# Altium schematic sheet Battery Management.SchDoc
size A
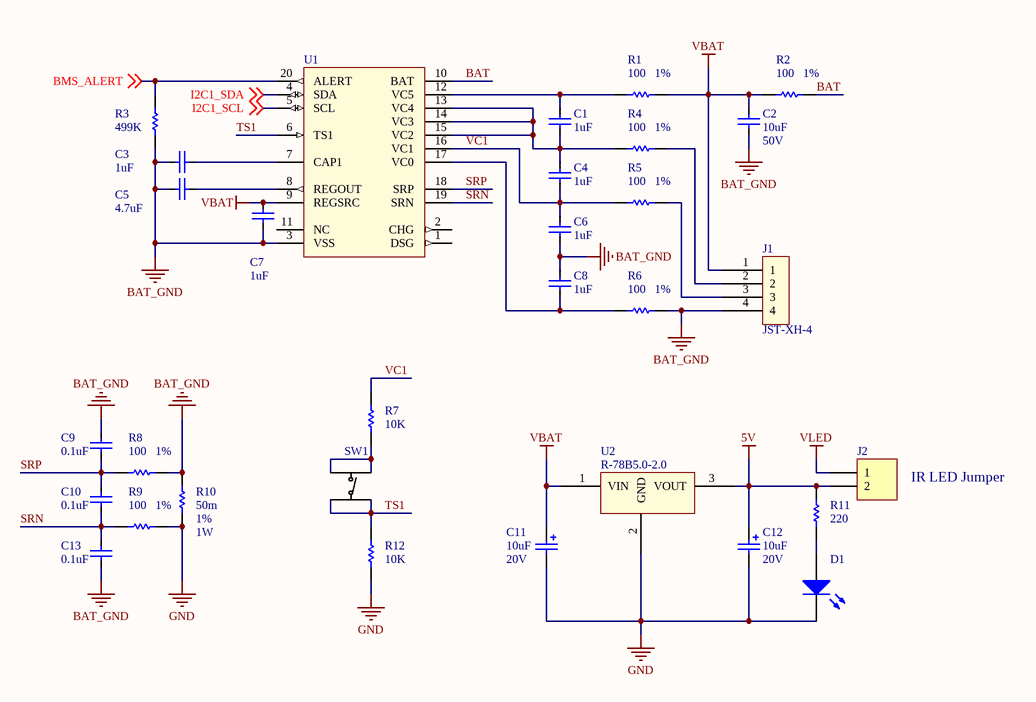
[diagram p0: Battery Management.SchDoc]

## Parts
C1  value 1uF  [C0805]  (hidden comment: CAP)
C2  value 10uF  Voltage - Rated: 50V  [1206]  (hidden comment: CAP)
C3  value 1uF  [C0805]  (hidden comment: CAP)
C4  value 1uF  [C0805]  (hidden comment: CAP)
C5  value 4.7uF  [C0805]  (hidden comment: CAP)
C6  value 1uF  [C0805]  (hidden comment: CAP)
C7  value 1uF  [C0805]  (hidden comment: CAP)
C8  value 1uF  [C0805]  (hidden comment: CAP)
C9  value 0.1uF  [J1-0603]  (hidden comment: CAP)
C10  value 0.1uF  [J1-0603]  (hidden comment: CAP)
C11  value 10uF  Voltage Rating: 20V  [1206+]  (hidden comment: CAP POL)
C12  value 10uF  Voltage Rating: 20V  [1206+]  (hidden comment: CAP POL)
C13  value 0.1uF  [J1-0603]  (hidden comment: CAP)
D1  LED  [0603-DI-GREEN]  (value not drawn)
J1  JST-XH-4  [JST-XH-4]
J2  Header 2  [HDR1X2]  (value not drawn)
R1  value 100  Tolerance: 1%  [J1-0603]
R2  value 100  Tolerance: 1%  [J1-0603]
R3  value 499K  [J1-0603]
R4  value 100  Tolerance: 1%  [J1-0603]
R5  value 100  Tolerance: 1%  [J1-0603]
R6  value 100  Tolerance: 1%  [J1-0603]
R7  value 10K  [J1-0603]
R8  value 100  Tolerance: 1%  [J1-0603]
R9  value 100  Tolerance: 1%  [J1-0603]
R10  value 50m  Tolerance: 1%  Power Rating: 1W  [RESC6332]
R11  value 220  [J1-0603]
R12  value 10K  [J1-0603]
SW1  TACT SWITCH  [TACT SWITCH]  (value not drawn)
U1  bq76920  [TSSOP20]  (value not drawn)
U2  Manufacturer Part Number: R-78B5.0-2.0  [SIP-3]  (hidden comment: R-78BXX-XX)

## Nets
5V: C12.1 J2.2 R11.1 U2.3(VOUT)
BAT_GND: C2.2 C3.1 C5.2 C6.1 C7.1 C8.2 C9.2 C13.1 J1.4 R3.1 R6.1 R8.1 R10.1 U1.3(VSS)
GND: C11.2 C12.2 D1.2(K) R9.1 R10.2 R12.2 U2.2(GND)
VBAT: C2.1 C7.2 C11.1 J1.1 R1.1 R2.2 U1.9(REGSRC) U2.1(VIN)
VLED: J2.1
BAT: R2.1 U1.10(BAT)
BMS_ALERT: R3.2 U1.20(ALERT) ; off-sheet BMS_ALERT
I2C1_SCL: U1.5(SCL) ; off-sheet I2C1_SCL
I2C1_SDA: U1.4(SDA) ; off-sheet I2C1_SDA
SRN: C10.1 C13.2 R9.2 U1.19(SRN)
SRP: C9.1 C10.2 R8.2 U1.18(SRP)
TS1: R12.1 SW1.3 SW1.4 U1.6(TS1)
VC1: C4.1 C6.2 R5.2 R7.1 U1.16(VC1)
NetC1_1: C1.1 C4.2 R4.2 U1.13(VC4) U1.14(VC3) U1.15(VC2)
NetC1_2: C1.2 R1.2 U1.12(VC5)
NetC3_2: C3.2 U1.7(CAP1)
NetC5_1: C5.1 U1.8(REGOUT)
NetC8_1: C8.1 R6.2 U1.17(VC0)
NetD1_1: D1.1(A) R11.2
NetJ1_2: J1.2 R4.1
NetJ1_3: J1.3 R5.1
NetR7_2: R7.2 SW1.1 SW1.2

Not connected (* = marked no-connect by the designer): U1 1(DSG) 2(CHG) 11(NC)

## Notes on the sheet
- IR LED Jumper

## Library data of the parts
C1 C3 C4 C6-C8 = CAP: CAP CER 1UF 25V X7R 0805; Manufacturer: Murata Electronics North America; Manufacturer Part Number: GCM21BR71E105KA56L; Tolerance: ±10%; Supplier 1: Digi-Key; Supplier Part Number 1: 490-4785-1-ND; RoHS: RoHS Compliant; Category: Capacitors; Stock 1: 30000; Pricing 1: 1=0.29, 10=0.198, 100=0.1122, 500=0.07918, 1000=0.06927 (USD); Packaging: Cut Tape (CT); Part Status: Active; Voltage - Rated: 25V; Temperature Coefficient: X7R; Operating Temperature: -55°C ~ 125°C; Features: -; Ratings: AEC-Q200; Applications: Automotive; Mounting Type: Surface Mount, MLCC; Package / Case: 0805 (2012 Metric); Size / Dimension: 0.079" L x 0.049" W (2.00mm x 1.25mm); Height - Seated (Max): -; Thickness (Max): 0.055" (1.40mm); Lead Spacing: -; Lead Style: -; ComponentLink1URL: http://search.murata.co.jp/Ceramy/image/img/A01X/G101/ENG/GCM21BR71E105KA56-01.pdf; ComponentLink1Description: http://search.murata.co.jp/Ceramy/image/img/A01X/G101/ENG/GCM21BR71E105KA56-01.pdf
C2 = CAP: CAP CER 10UF 50V X5R 1206; Manufacturer: Murata Electronics North America; Manufacturer Part Number: GRT31CR61H106KE01L; Tolerance: ±10%; Supplier 1: Digi-Key; Supplier Part Number 1: 490-12456-1-ND; RoHS: RoHS Compliant; Category: Capacitors; Stock 1: 20000; Pricing 1: 1=0.89, 10=0.633, 100=0.4166, 500=0.30856, 1000=0.26228 (USD); Packaging: Cut Tape (CT); Part Status: Active; Temperature Coefficient: X5R; Operating Temperature: -55°C ~ 85°C; Features: -; Ratings: AEC-Q200; Applications: Automotive; Mounting Type: Surface Mount, MLCC; Package / Case: 1206 (3216 Metric); Size / Dimension: 0.126" L x 0.063" W (3.20mm x 1.60mm); Height - Seated (Max): -; Thickness (Max): 0.071" (1.80mm); Lead Spacing: -; Lead Style: -; ComponentLink1URL: http://search.murata.co.jp/Ceramy/image/img/A01X/G101/ENG/GRT31CR61H106KE01-01.pdf; ComponentLink1Description: http://search.murata.co.jp/Ceramy/image/img/A01X/G101/ENG/GRT31CR61H106KE01-01.pdf
C5 = CAP: CAP CER 4.7UF 10V X7R 0805; Manufacturer: Samsung Electro-Mechanics; Manufacturer Part Number: CL21B475KPFNNNE; Tolerance: ±10%; Notification: Current market demand for these product types have resulted in fluctuating and extending lead times. Lead times may differ.; Supplier 1: Digi-Key; Supplier Part Number 1: 1276-2972-1-ND; RoHS: RoHS Compliant; Category: Capacitors; Stock 1: 20000; Pricing 1: 1=0.28, 10=0.19, 100=0.0963, 500=0.06588, 1000=0.05828 (USD); Packaging: Cut Tape (CT); Part Status: Active; Voltage - Rated: 10V; Temperature Coefficient: X7R; Operating Temperature: -55°C ~ 125°C; Features: -; Ratings: -; Applications: General Purpose; Mounting Type: Surface Mount, MLCC; Package / Case: 0805 (2012 Metric); Size / Dimension: 0.079" L x 0.049" W (2.00mm x 1.25mm); Height - Seated (Max): -; Thickness (Max): 0.053" (1.35mm); Lead Spacing: -; Lead Style: -; ComponentLink1URL: http://www.samsungsem.com/kr/support/product-search/mlcc/CL21B475KPFNNNE.jsp; ComponentLink1Description: http://www.samsungsem.com/kr/support/product-search/mlcc/CL21B475KPFNNNE.jsp
C9 C10 C13 = CAP: CAP CER 0.1UF 50V X7R 0603; Supplier Part Number 1: 399-6856-1-ND; Voltage Rating: 50V; Supplier 1: Digi-Key
C11 C12 = CAP POL: CAP TANT 10UF 10% 20V 1206; Published: 8-Jun-2000; LatestRevisionDate: 17-Jul-2002; LatestRevisionNote: Re-released for DXP Platform.; PackageReference: RB7.6-15; Publisher: Altium Limited; PackageDescription: Polarized Capacitor (Radial); 2 Leads; Supplier Part Number 1: 478-8273-1-ND; Supplier 1: Digi-Key
D1 = LED: LED GREEN CLEAR CHIP SMD; Published: 8-Jun-2000; LatestRevisionDate: 17-Jul-2002; LatestRevisionNote: Re-released for DXP Platform.; PackageVersion: Feb-2002; PackageReference: 3.2X1.6X1.1; Publisher: Altium Limited; PackageDescription: SM LED; 2 Flat Leads; Supplier Part Number 1: 160-1888-1-ND; Supplier 1: Digi-Key
J1 = JST-XH-4: CONN HEADER R/A 4POS 2.5MM; Manufacturer: JST Sales America Inc.; Manufacturer Part Number: S4B-XH-A(LF)(SN); Pitch - Mating: 0.098" (2.50mm); Number of Positions: 4; Number of Positions Loaded: All; Style: Board to Cable/Wire; Shrouding: Shrouded - 4 Wall; Contact Length - Post: 0.134" (3.40mm); Material Flammability Rating: UL94 V-0; Current Rating: 3A; Voltage Rating: 250V; Mated Stacking Heights: 6.1mm; Supplier 1: Digi-Key; RoHS: RoHS Compliant; Category: Connectors, Interconnects; Stock 1: 46156; Pricing 1: 1=0.27, 10=0.257, 100=0.1785, 500=0.151, 1000=0.12355, 5000=0.10982, 10000=0.09953 (USD); Packaging: Bulk; Part Status: Active; Connector Type: Header; Contact Type: Male Pin; Number of Rows: 1; Row Spacing - Mating: -; Mounting Type: Through Hole, Right Angle; Termination: Press-Fit, Solder; Fastening Type: Detent Lock; Contact Length - Mating: -; Overall Contact Length: -; Insulation Height: 0.240" (6.10mm); Contact Shape: Square; Contact Finish - Mating: Tin; Contact Finish Thickness - Mating: -; Contact Finish - Post: Tin; Contact Material: Brass; Insulation Material: Polyamide (PA66), Nylon 6/6; Features: -; Operating Temperature: -25°C ~ 85°C; Ingress Protection: -; Insulation Color: Natural; Contact Finish Thickness - Post: -; Applications: -; ComponentLink1URL: http://www.jst-mfg.com/product/pdf/eng/eXH.pdf; ComponentLink1Description: http://www.jst-mfg.com/product/pdf/eng/eXH.pdf; Supplier Part Number 1: 455-2243-ND
J2 = Header 2: Header, 2-Pin; LatestRevisionDate: 17-Jul-2002; LatestRevisionNote: Re-released for DXP Platform.; Publisher: Altium Limited
R1 R2 R4-R6 R8 R9 = Res1: RES SMD 100 OHM 1% 1/10W 0603; Supplier Part Number 1: 311-100HRCT-ND; Supplier 1: Digi-Key
R3 = Res1: RES SMD 499K OHM 1% 1/10W 0603; Supplier Part Number 1: 311-499KHRCT-ND; Supplier 1: Digi-Key
R7 R12 = Res1: RES SMD 10K OHM 5% 1/10W 0603; Supplier Part Number 1: 311-10KGRCT-ND; Supplier 1: Digi-Key
R10 = Res1: RES 0.05 OHM 1% 1W 2512; Supplier Part Number 1: 311-0.05TCT-ND; Supplier 1: Digi-Key
R11 = Res1: RES SMD 220 OHM 5% 1/10W 0603; Supplier Part Number 1: 311-220GRCT-ND; Supplier 1: Digi-Key
SW1 = TACT SWITCH: SWITCH TACTILE SPST-NO 0.05A 12V; Manufacturer: C&K; Manufacturer Part Number: PTS645SL50SMTR92 LFS; Switch Function: Off-Mom; Contact Rating @ Voltage: 0.05A @ 12VDC; Actuator Type: Standard; Actuator Height off PCB, Vertical: 5.00mm; Actuator Orientation: Top Actuated; Outline: 6.00mm x 6.00mm; Illumination: Non-Illuminated; Operating Force: 130gf; Actuator Material: Polyamide (PA66), Nylon 6/6; Mechanical Life: 100,000 Cycles; Supplier 1: Digi-Key; RoHS: RoHS Compliant; Category: Switches; Stock 1: 42939; Pricing 1: 1=0.22, 10=0.215, 25=0.2076, 50=0.2002, 100=0.1891, 250=0.17796, 500=0.17054 (USD); Packaging: Cut Tape (CT); Part Status: Active; Circuit: SPST-NO; Mounting Type: Surface Mount; Actuator Length, Right Angle: -; Termination Style: Gull Wing; Illumination Type, Color: -; Illumination Voltage (Nominal): -; Ingress Protection: -; Features: -; Operating Temperature: -20°C ~ 60°C; Switch Travel: -; ComponentLink1URL: https://www.ckswitches.com/media/1471/pts645.pdf; ComponentLink1Description: https://www.ckswitches.com/media/1471/pts645.pdf; Supplier Part Number 1: CKN9088CT-ND
U1 = bq76920: IC BATT MGMT LI-ION AFE 20TSSOP; Supplier 1: Digi-Key; Supplier Part Number 1: 296-39960-1-ND
U2 = R-78BXX-XX: DC DC CONVERTER 5V; Manufacturer: Recom Power; Voltage - Input (Min): 6.5V; Voltage - Input (Max): 32V; Current - Output (Max): 2A; Efficiency: 94%; Supplier 1: Digi-Key; Supplier Part Number 1: 945-3042-ND; RoHS: RoHS Compliant; Category: Power Supplies - Board Mount; Stock 1: 3257; Pricing 1: 1=9.87, 5=9.792, 10=9.718, 42=9.5681, 84=9.26905, 126=8.37198, 252=8.2225, 504=8.073 (USD); Packaging: Tube; Part Status: Active; Type: Linear Regulator Replacement; Voltage - Output 1: 5V; Voltage - Output 2: -; Voltage - Output 3: -; Applications: ITE (Commercial); Features: OTP, SCP; Operating Temperature: -40°C ~ 70°C; Mounting Type: Through Hole; Package / Case: 3-SIP Module; Size / Dimension: 0.45" L x 0.33" W x 0.69" H (11.5mm x 8.5mm x 17.5mm); Supplier Device Package: -; Control Features: -; ComponentLink1URL: https://www.recom-power.com/pdf/Innoline/R-78Bxx-2.0.pdf; ComponentLink1Description: https://www.recom-power.com/pdf/Innoline/R-78Bxx-2.0.pdf